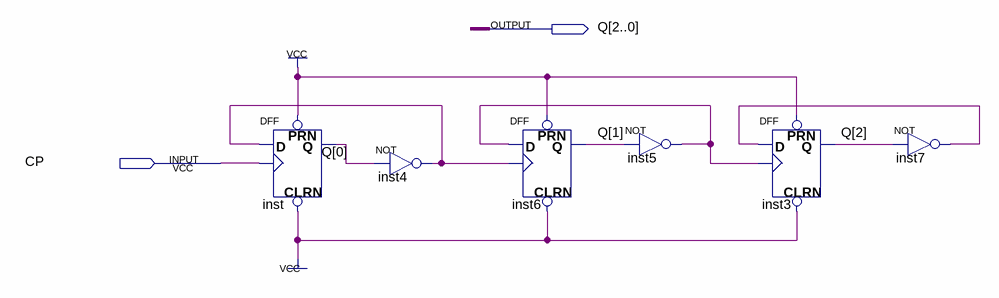
[diagram p0: schematic sheet]
// Quartus schematic lab2.bdf as structural Verilog: 6 symbols, 2 pins
module lab2 (
  input  CP,
  output [2:0] Q
);

  wire inst4_out, inst5_out, inst7_out;

  DFF inst (.CLRN(1'b1), .CLK(CP), .D(inst4_out), .PRN(1'b1), .Q(Q[0]));
  not inst4 (inst4_out, Q[0]);
  DFF inst6 (.CLRN(1'b1), .CLK(inst4_out), .D(inst5_out), .PRN(1'b1), .Q(Q[1]));
  not inst5 (inst5_out, Q[1]);
  DFF inst3 (.CLRN(1'b1), .CLK(inst5_out), .D(inst7_out), .PRN(1'b1), .Q(Q[2]));
  not inst7 (inst7_out, Q[2]);
endmodule
